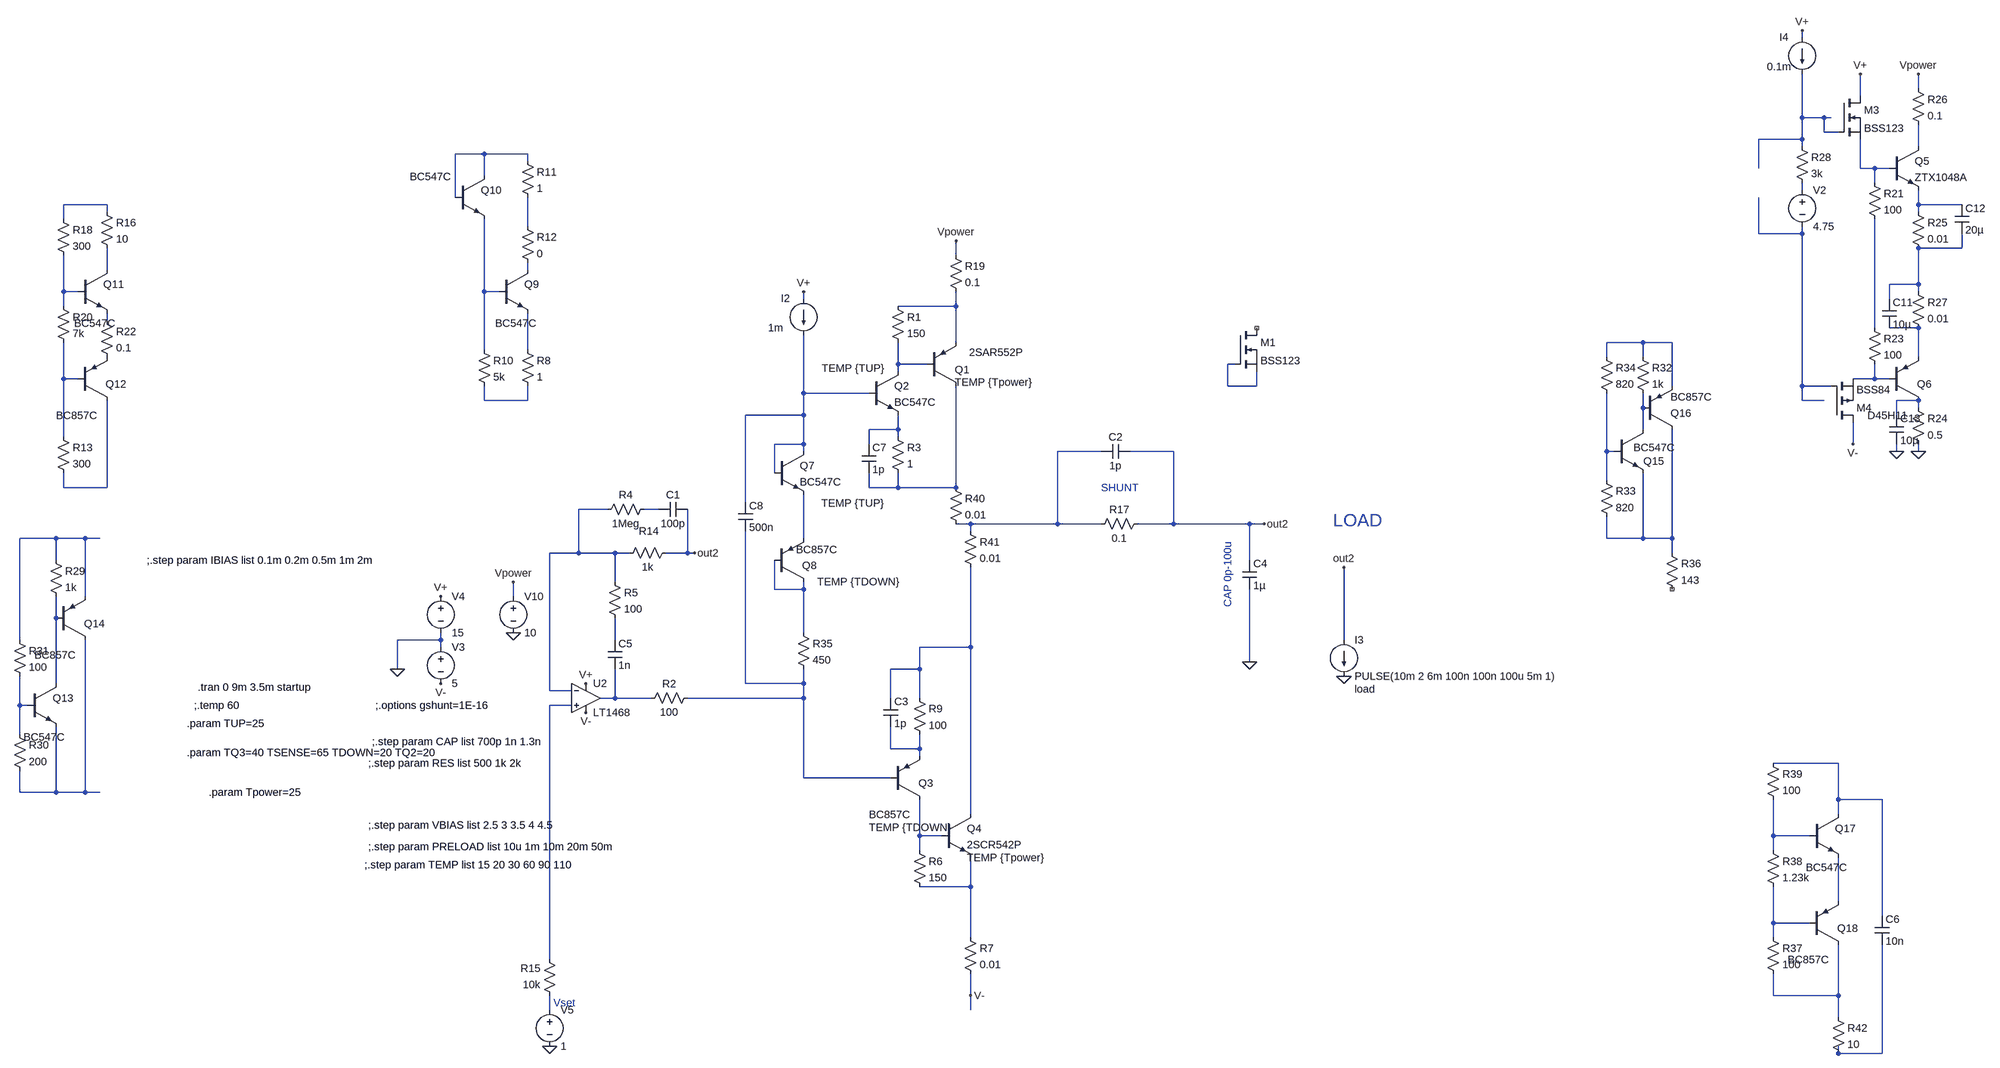
[diagram p0: schematic super_fast_push_pull_pass_element_selection.asc]
super_fast_push_pull_pass_element_selection.asc, the LTspice schematic file:
Version 4
SHEET 1 8456 1444
WIRE 2608 -864 2608 -880
WIRE 2864 -752 2864 -784
WIRE 2736 -736 2736 -784
WIRE 2608 -688 2608 -784
WIRE 2656 -688 2608 -688
WIRE 2672 -688 2656 -688
WIRE 2656 -656 2656 -688
WIRE 2688 -656 2656 -656
WIRE 2608 -640 2608 -688
WIRE 2608 -640 2512 -640
WIRE 2608 -624 2608 -640
WIRE 2864 -624 2864 -672
WIRE -608 -608 -672 -608
WIRE -512 -608 -608 -608
WIRE -512 -592 -512 -608
WIRE 2512 -576 2512 -640
WIRE 2736 -576 2736 -640
WIRE 2768 -576 2736 -576
WIRE 2800 -576 2768 -576
WIRE -608 -560 -608 -608
WIRE 2768 -544 2768 -576
WIRE 2608 -528 2608 -544
WIRE -672 -512 -672 -608
WIRE -1440 -496 -1536 -496
WIRE 2864 -496 2864 -528
WIRE 2960 -496 2864 -496
WIRE -1440 -480 -1440 -496
WIRE 2864 -480 2864 -496
WIRE -1536 -464 -1536 -496
WIRE -512 -448 -512 -512
WIRE 2512 -432 2512 -512
WIRE 2608 -432 2608 -448
WIRE 2608 -432 2512 -432
WIRE 2960 -400 2960 -432
WIRE 2960 -400 2864 -400
WIRE 432 -384 432 -416
WIRE -1440 -352 -1440 -400
WIRE -512 -352 -512 -368
WIRE 2864 -320 2864 -400
WIRE 2864 -320 2800 -320
WIRE -1536 -304 -1536 -384
WIRE -1504 -304 -1536 -304
WIRE -608 -304 -608 -464
WIRE -576 -304 -608 -304
WIRE 2864 -304 2864 -320
WIRE 96 -288 96 -304
WIRE 2800 -288 2800 -320
WIRE -1536 -272 -1536 -304
WIRE 432 -272 432 -304
WIRE 432 -272 304 -272
WIRE -1440 -240 -1440 -256
WIRE 2768 -224 2768 -464
WIRE 2864 -224 2800 -224
WIRE 432 -192 432 -272
WIRE 2192 -192 2112 -192
WIRE 2256 -192 2192 -192
WIRE -608 -176 -608 -304
WIRE -512 -176 -512 -256
WIRE 2112 -160 2112 -192
WIRE 2192 -160 2192 -192
WIRE 2864 -160 2864 -224
WIRE 304 -144 304 -192
WIRE 368 -144 304 -144
WIRE 1184 -144 1168 -144
WIRE 304 -128 304 -144
WIRE -1536 -112 -1536 -192
WIRE -1504 -112 -1536 -112
WIRE 2768 -112 2768 -144
WIRE 2768 -112 2720 -112
WIRE 2800 -112 2768 -112
WIRE 1168 -96 1168 -144
WIRE 1232 -96 1232 -128
WIRE 1232 -96 1168 -96
WIRE 2256 -96 2256 -192
WIRE 2608 -96 2608 -432
WIRE 2672 -96 2608 -96
WIRE 96 -80 96 -208
WIRE 240 -80 96 -80
WIRE -608 -64 -608 -96
WIRE -512 -64 -512 -96
WIRE -512 -64 -608 -64
WIRE 2608 -64 2608 -96
WIRE 2656 -64 2608 -64
WIRE 2864 -64 2816 -64
WIRE 2192 -48 2192 -80
WIRE 2864 -48 2864 -64
WIRE 96 -32 96 -80
WIRE 96 -32 -32 -32
WIRE 2816 -32 2816 -64
WIRE 304 0 304 -32
WIRE 304 0 240 0
WIRE 2192 0 2192 -48
WIRE -1536 16 -1536 -112
WIRE 304 16 304 0
WIRE 96 32 96 -32
WIRE 96 32 32 32
WIRE 240 32 240 0
WIRE 2720 32 2720 -16
WIRE 96 48 96 32
WIRE 752 48 656 48
WIRE 912 48 816 48
WIRE 2112 48 2112 -80
WIRE 2128 48 2112 48
WIRE 2816 48 2816 32
WIRE 2864 48 2864 32
WIRE 32 96 32 32
WIRE 2112 112 2112 48
WIRE -1536 128 -1536 96
WIRE -1440 128 -1440 -64
WIRE -1440 128 -1536 128
WIRE 240 128 240 96
WIRE 304 128 304 96
WIRE 304 128 240 128
WIRE 432 128 432 -96
WIRE 432 128 304 128
WIRE -32 160 -32 -32
WIRE -336 176 -400 176
WIRE -224 176 -256 176
WIRE 464 208 432 208
WIRE 656 208 656 48
WIRE 656 208 464 208
WIRE 752 208 656 208
WIRE 912 208 912 48
WIRE 912 208 832 208
WIRE 1216 208 912 208
WIRE 1248 208 1216 208
WIRE 464 224 464 208
WIRE -1552 240 -1632 240
WIRE -1488 240 -1552 240
WIRE -1456 240 -1488 240
WIRE 96 240 96 144
WIRE 2112 240 2112 192
WIRE 2192 240 2192 96
WIRE 2192 240 2112 240
WIRE 2256 240 2256 0
WIRE 2256 240 2192 240
WIRE -400 272 -400 176
WIRE -400 272 -464 272
WIRE -320 272 -400 272
WIRE -288 272 -320 272
WIRE -160 272 -160 176
WIRE -160 272 -208 272
WIRE -144 272 -160 272
WIRE 2256 272 2256 240
WIRE -1552 288 -1552 240
WIRE 1216 288 1216 208
WIRE -320 336 -320 272
WIRE 32 352 32 288
WIRE 96 352 96 336
WIRE 96 352 32 352
WIRE -1488 368 -1488 240
WIRE -544 368 -544 336
WIRE -1552 416 -1552 368
WIRE 96 448 96 352
WIRE -1632 464 -1632 240
WIRE -704 464 -704 448
WIRE -704 464 -800 464
WIRE -320 464 -320 416
WIRE 1424 464 1424 304
WIRE -704 480 -704 464
WIRE 464 480 464 304
WIRE 464 480 352 480
WIRE 1216 512 1216 352
WIRE -800 528 -800 464
WIRE 352 528 352 480
WIRE 352 528 288 528
WIRE -1552 560 -1552 416
WIRE -32 560 -32 224
WIRE 96 560 96 528
WIRE 96 560 -32 560
WIRE -464 576 -464 272
WIRE -416 576 -464 576
WIRE -320 592 -320 528
WIRE -320 592 -352 592
WIRE -240 592 -320 592
WIRE 96 592 96 560
WIRE 96 592 -160 592
WIRE 288 592 288 528
WIRE 352 592 352 528
WIRE -1632 608 -1632 544
WIRE -1616 608 -1632 608
WIRE -416 608 -464 608
WIRE -1632 672 -1632 608
WIRE 288 704 288 656
WIRE 352 704 352 672
WIRE 352 704 288 704
WIRE 352 720 352 704
WIRE 2688 736 2544 736
WIRE 96 768 96 592
WIRE 288 768 96 768
WIRE -1632 800 -1632 752
WIRE -1552 800 -1552 656
WIRE -1552 800 -1632 800
WIRE -1488 800 -1488 464
WIRE -1488 800 -1552 800
WIRE -1456 800 -1488 800
WIRE 2688 816 2688 736
WIRE 2784 816 2688 816
WIRE 464 848 464 480
WIRE 2688 848 2688 816
WIRE 352 896 352 816
WIRE 400 896 352 896
WIRE 2544 896 2544 816
WIRE 2624 896 2544 896
WIRE 352 928 352 896
WIRE 2544 928 2544 896
WIRE 464 1008 464 944
WIRE 464 1008 352 1008
WIRE 2688 1040 2688 944
WIRE 2784 1072 2784 816
WIRE 2544 1088 2544 1008
WIRE 2624 1088 2544 1088
WIRE 464 1120 464 1008
WIRE 2544 1120 2544 1088
WIRE -464 1168 -464 608
WIRE 464 1248 464 1200
WIRE 2544 1248 2544 1200
WIRE 2688 1248 2688 1136
WIRE 2688 1248 2544 1248
WIRE -464 1280 -464 1248
WIRE 464 1280 464 1248
WIRE 2688 1296 2688 1248
WIRE 2688 1376 2688 1360
WIRE 2784 1376 2784 1136
WIRE 2784 1376 2688 1376
FLAG -800 528 0
FLAG -704 368 V+
FLAG -704 560 V-
FLAG -384 560 V+
FLAG -384 624 V-
FLAG 1248 208 out2
FLAG 1216 512 0
FLAG -464 1360 0
FLAG 1424 304 out2
FLAG -144 272 out2
FLAG -544 336 Vpower
FLAG -544 448 0
FLAG 432 -416 Vpower
FLAG 96 -304 V+
FLAG 1424 544 0
FLAG 2864 48 0
FLAG 2720 32 V-
FLAG 2864 -784 Vpower
FLAG 2736 -784 V+
FLAG 2608 -880 V+
FLAG 2816 48 0
FLAG 464 1248 V-
DATAFLAG 1136 208 ""
SYMBOL voltage -704 464 R0
WINDOW 123 0 0 Left 0
WINDOW 39 0 0 Left 0
SYMATTR InstName V3
SYMATTR Value 5
SYMBOL voltage -704 352 R0
WINDOW 123 0 0 Left 0
WINDOW 39 0 0 Left 0
SYMATTR InstName V4
SYMATTR Value 15
SYMBOL cap -336 464 R0
SYMATTR InstName C5
SYMATTR Value 1n
SYMBOL res -192 256 R90
WINDOW 0 -16 53 VBottom 2
WINDOW 3 32 56 VTop 2
SYMATTR InstName R14
SYMATTR Value 1k
SYMBOL res -448 1264 R180
WINDOW 0 36 76 Left 2
WINDOW 3 36 40 Left 2
SYMATTR InstName R15
SYMATTR Value 10k
SYMBOL res 736 224 R270
WINDOW 0 32 56 VTop 2
WINDOW 3 0 56 VBottom 2
SYMATTR InstName R17
SYMATTR Value 0.1
SYMBOL cap 1200 288 R0
SYMATTR InstName C4
SYMATTR Value 1µ
SYMATTR SpiceLine Rser=0.1
SYMBOL voltage -464 1264 R0
WINDOW 123 0 0 Left 0
WINDOW 39 0 0 Left 0
SYMATTR InstName V5
SYMATTR Value 1
SYMBOL OpAmps\\LT1468 -384 528 R0
SYMATTR InstName U2
SYMBOL res -144 576 R90
WINDOW 0 0 56 VBottom 2
WINDOW 3 32 56 VTop 2
SYMATTR InstName R2
SYMATTR Value 100
SYMBOL voltage -544 352 R0
WINDOW 123 0 0 Left 0
WINDOW 39 0 0 Left 0
SYMATTR InstName V10
SYMATTR Value 10
SYMBOL res -336 320 R0
SYMATTR InstName R5
SYMATTR Value 100
SYMBOL current 96 -288 R0
WINDOW 0 -50 -1 Left 2
WINDOW 3 -78 64 Left 2
WINDOW 123 0 0 Left 0
WINDOW 39 0 0 Left 0
SYMATTR InstName I2
SYMATTR Value 1m
SYMBOL current 1424 464 R0
WINDOW 123 0 0 Left 0
WINDOW 39 24 108 Left 2
SYMATTR SpiceLine load
SYMATTR InstName I3
SYMATTR Value PULSE(10m 2 6m 100n 100n 100u 5m 1)
SYMBOL cap -160 160 R90
WINDOW 0 0 32 VBottom 2
WINDOW 3 32 32 VTop 2
SYMATTR InstName C1
SYMATTR Value 100p
SYMBOL res -240 160 R90
WINDOW 0 0 56 VBottom 2
WINDOW 3 32 56 VTop 2
SYMATTR InstName R4
SYMATTR Value 1Meg
SYMBOL cap 816 32 R90
WINDOW 0 0 32 VBottom 2
WINDOW 3 32 32 VTop 2
SYMATTR InstName C2
SYMATTR Value 1p
SYMBOL res 416 -400 R0
SYMATTR InstName R19
SYMATTR Value 0.1
SYMBOL npn 2800 -624 R0
SYMATTR InstName Q5
SYMATTR Value ZTX1048A
SYMBOL nmos 2688 -736 R0
SYMATTR InstName M3
SYMATTR Value BSS123
SYMBOL pnp 2800 -64 M180
WINDOW 0 61 36 Left 2
WINDOW 3 -48 -33 Left 2
SYMATTR InstName Q6
SYMATTR Value D45H11
SYMBOL pmos 2672 -16 M180
SYMATTR InstName M4
SYMATTR Value BSS84
SYMBOL voltage 2608 -544 R0
WINDOW 123 0 0 Left 0
WINDOW 39 0 0 Left 0
SYMATTR InstName V2
SYMATTR Value 4.75
SYMBOL current 2608 -864 R0
WINDOW 0 -50 -1 Left 2
WINDOW 3 -78 64 Left 2
WINDOW 123 0 0 Left 0
WINDOW 39 0 0 Left 0
SYMATTR InstName I4
SYMATTR Value 0.1m
SYMBOL res 2752 -560 R0
SYMATTR InstName R21
SYMATTR Value 100
SYMBOL res 2752 -240 R0
SYMATTR InstName R23
SYMATTR Value 100
SYMBOL res 2848 -64 R0
SYMATTR InstName R24
SYMATTR Value 0.5
SYMBOL res 2848 -496 R0
SYMATTR InstName R25
SYMATTR Value 0.01
SYMBOL res 2848 -768 R0
SYMATTR InstName R26
SYMATTR Value 0.1
SYMBOL cap 2784 -288 R0
SYMATTR InstName C11
SYMATTR Value 10µ
SYMBOL res 2848 -320 R0
SYMATTR InstName R27
SYMATTR Value 0.01
SYMBOL cap 2944 -496 R0
SYMATTR InstName C12
SYMATTR Value 20µ
SYMBOL res 2592 -640 R0
SYMATTR InstName R28
SYMATTR Value 3k
SYMBOL cap 2800 -32 R0
SYMATTR InstName C13
SYMATTR Value 10µ
SYMBOL npn 240 -128 R0
WINDOW 39 -104 -7 Left 2
SYMATTR SpiceLine TEMP {TUP}
SYMATTR InstName Q2
SYMATTR Value BC547C
SYMBOL pnp 368 -96 M180
WINDOW 0 61 36 Left 2
WINDOW 3 93 74 Left 2
WINDOW 39 61 8 Left 2
SYMATTR InstName Q1
SYMATTR Value 2SAR552P
SYMATTR SpiceLine TEMP {Tpower}
SYMBOL res 288 -288 R0
SYMATTR InstName R1
SYMATTR Value 150
SYMBOL res 288 0 R0
SYMATTR InstName R3
SYMATTR Value 1
SYMBOL nmos 1184 -224 R0
SYMATTR InstName M1
SYMATTR Value BSS123
SYMBOL pnp 288 816 M180
WINDOW 0 61 36 Left 2
WINDOW 3 -48 -33 Left 2
WINDOW 39 -48 -61 Left 2
SYMATTR InstName Q3
SYMATTR Value BC857C
SYMATTR SpiceLine TEMP {TDOWN}
SYMBOL npn 400 848 R0
WINDOW 39 56 96 Left 2
SYMATTR SpiceLine TEMP {Tpower}
SYMATTR InstName Q4
SYMATTR Value 2SCR542P
SYMBOL res 336 912 R0
SYMATTR InstName R6
SYMATTR Value 150
SYMBOL res 448 1104 R0
SYMATTR InstName R7
SYMATTR Value 0.01
SYMBOL npn 32 48 R0
WINDOW 39 103 114 Left 2
SYMATTR SpiceLine TEMP {TUP}
SYMATTR InstName Q7
SYMATTR Value BC547C
SYMBOL pnp 32 336 M180
WINDOW 0 61 36 Left 2
WINDOW 3 47 71 Left 2
WINDOW 39 94 0 Left 2
SYMATTR InstName Q8
SYMATTR Value BC857C
SYMATTR SpiceLine TEMP {TDOWN}
SYMBOL res 336 576 R0
SYMATTR InstName R9
SYMATTR Value 100
SYMBOL npn -576 -352 R0
WINDOW 3 -8 118 Left 2
SYMATTR Value BC547C
SYMATTR InstName Q9
SYMATTR SpiceLine TEMP {TQ2}
SYMBOL res -624 -192 R0
SYMATTR InstName R10
SYMATTR Value 5k
SYMBOL res -528 -608 R0
SYMATTR InstName R11
SYMATTR Value 1
SYMBOL cap 2768 1072 R0
SYMATTR InstName C6
SYMATTR Value 10n
SYMBOL npn -672 -560 R0
WINDOW 3 -100 2 Left 2
SYMATTR Value BC547C
SYMATTR InstName Q10
SYMATTR SpiceLine TEMP {TQ2}
SYMBOL res -528 -192 R0
SYMATTR InstName R8
SYMATTR Value 1
SYMBOL res -528 -464 R0
SYMATTR InstName R12
SYMATTR Value 0
SYMBOL npn -1504 -352 R0
WINDOW 3 -8 118 Left 2
SYMATTR Value BC547C
SYMATTR InstName Q11
SYMATTR SpiceLine TEMP {TQ2}
SYMBOL res -1552 0 R0
SYMATTR InstName R13
SYMATTR Value 300
SYMBOL pnp -1504 -64 M180
WINDOW 0 61 36 Left 2
WINDOW 3 -48 -33 Left 2
SYMATTR InstName Q12
SYMATTR Value BC857C
SYMATTR SpiceLine TEMP {TQ2}
SYMBOL res -1552 -480 R0
SYMATTR InstName R18
SYMATTR Value 300
SYMBOL res -1552 -288 R0
SYMATTR InstName R20
SYMATTR Value 7k
SYMBOL res -1456 -496 R0
SYMATTR InstName R16
SYMATTR Value 10
SYMBOL res -1456 -256 R0
SYMATTR InstName R22
SYMATTR Value 0.1
SYMBOL npn -1616 560 R0
WINDOW 3 -8 118 Left 2
SYMATTR Value BC547C
SYMATTR InstName Q13
SYMATTR SpiceLine TEMP {TQ2}
SYMBOL pnp -1552 464 M180
WINDOW 0 61 36 Left 2
WINDOW 3 -48 -33 Left 2
SYMATTR InstName Q14
SYMATTR Value BC857C
SYMATTR SpiceLine TEMP {TQ2}
SYMBOL res -1568 272 R0
SYMATTR InstName R29
SYMATTR Value 1k
SYMBOL res -1648 656 R0
SYMATTR InstName R30
SYMATTR Value 200
SYMBOL res -1648 448 R0
SYMATTR InstName R31
SYMATTR Value 100
SYMBOL npn 2128 0 R0
WINDOW 3 43 40 Left 2
WINDOW 0 65 70 Left 2
SYMATTR Value BC547C
SYMATTR InstName Q15
SYMATTR SpiceLine TEMP {TSENSE}
SYMBOL pnp 2192 0 M180
WINDOW 0 61 36 Left 2
WINDOW 3 61 72 Left 2
SYMATTR InstName Q16
SYMATTR Value BC857C
SYMATTR SpiceLine TEMP {TQ2}
SYMBOL res 2176 -176 R0
SYMATTR InstName R32
SYMATTR Value 1k
SYMBOL res 2096 96 R0
SYMATTR InstName R33
SYMATTR Value 820
SYMBOL res 2096 -176 R0
SYMATTR InstName R34
SYMATTR Value 820
SYMBOL res 2240 256 R0
SYMATTR InstName R36
SYMATTR Value 143
SYMBOL npn 2624 848 R0
WINDOW 3 -8 118 Left 2
SYMATTR Value BC547C
SYMATTR InstName Q17
SYMATTR SpiceLine TEMP {TUP}
SYMBOL pnp 2624 1136 M180
WINDOW 0 61 36 Left 2
WINDOW 3 -48 -33 Left 2
SYMATTR InstName Q18
SYMATTR Value BC857C
SYMATTR SpiceLine TEMP {TUP}
SYMBOL res 2528 1104 R0
SYMATTR InstName R37
SYMATTR Value 100
SYMBOL res 2528 912 R0
SYMATTR InstName R38
SYMATTR Value 1.23k
SYMBOL res 2528 720 R0
SYMATTR InstName R39
SYMATTR Value 100
SYMBOL res 2672 1280 R0
SYMATTR InstName R42
SYMATTR Value 10
SYMBOL cap 272 592 R0
SYMATTR InstName C3
SYMATTR Value 1p
SYMATTR SpiceLine Rser=1
SYMBOL cap 224 32 R0
SYMATTR InstName C7
SYMATTR Value 1p
SYMATTR SpiceLine Rser=1
SYMBOL res 80 432 R0
SYMATTR InstName R35
SYMATTR Value 450
SYMBOL cap -48 160 R0
SYMATTR InstName C8
SYMATTR Value 500n
SYMBOL res 416 112 R0
SYMATTR InstName R40
SYMATTR Value 0.01
SYMBOL res 448 208 R0
SYMATTR InstName R41
SYMATTR Value 0.01
TEXT -1240 568 Left 2 !.tran 0 9m 3.5m startup
TEXT -456 1264 Left 2 ;Vset
TEXT 752 128 Left 2 ;SHUNT
TEXT 1400 200 Left 4 ;LOAD
TEXT 1168 392 VLeft 2 ;CAP 0p-100u
TEXT -856 688 Left 2 !;.step param CAP list 700p 1n 1.3n
TEXT -864 736 Left 2 !;.step param RES list 500 1k 2k
TEXT -1352 288 Left 2 !;.step param IBIAS list 0.1m 0.2m 0.5m 1m 2m
TEXT -864 872 Left 2 !;.step param VBIAS list 2.5 3 3.5 4 4.5
TEXT -864 920 Left 2 !;.step param PRELOAD list 10u 1m 10m 20m 50m
TEXT -1248 608 Left 2 !;.temp 60
TEXT -872 960 Left 2 !;.step param TEMP list 15 20 30 60 90 110
TEXT -848 608 Left 2 !;.options gshunt=1E-16
TEXT -1264 648 Left 2 !.param TUP=25
TEXT -1264 712 Left 2 !.param TQ3=40 TSENSE=65 TDOWN=20 TQ2=20
TEXT -1216 800 Left 2 !.param Tpower=25

The netlist it stands for:
* super_fast_push_pull_pass_element_selection.asc
V3 0 V- 5
V4 V+ 0 15
C5 N041 N044 1n
R14 out2 N034 1k
R15 N056 N046 10k
R17 N030 out2 0.1
C4 out2 0 1µ Rser=0.1
V5 N056 0 1
XU2 N046 N034 V+ V- N044 LT1468  ; pins In+ In- V+ V- OUT
R2 N043 N044 100
V10 Vpower 0 10
R5 N034 N041 100
I2 V+ N025 1m
I3 out2 0 PULSE(10m 2 6m 100n 100n 100u 5m 1) load
C1 out2 N035 100p
R4 N035 N034 1Meg
C2 out2 N030 1p
R19 Vpower N015 0.1
Q5 N002 N004 N007 0 ZTX1048A
M3 V+ N001 N004 N004 BSS123
Q6 N027 N024 N018 0 D45H11
M4 V- N009 N024 N024 BSS84
V2 N005 N009 4.75
I4 V+ N001 0.1m
R21 N004 N017 100
R23 N017 N024 100
R24 N027 0 0.5
R25 N007 N010 0.01
R26 Vpower N002 0.1
C11 N010 N018 10µ
R27 N010 N018 0.01
C12 N007 N010 20µ
R28 N001 N005 3k
C13 N027 0 10µ
Q2 N021 N025 N029 0 BC547C TEMP {TUP}
Q1 N033 N021 N015 0 2SAR552P TEMP {Tpower}
R1 N015 N021 150
R3 N029 N033 1
M1 NC_01 N022 N022 N022 BSS123
Q3 N050 N043 N047 0 BC857C TEMP {TDOWN}
Q4 N042 N050 N052 0 2SCR542P TEMP {Tpower}
R6 N050 N052 150
R7 N052 V- 0.01
Q7 N025 N025 N037 0 BC547C TEMP {TUP}
Q8 N039 N039 N037 0 BC857C TEMP {TDOWN}
R9 N042 N047 100
Q9 N012 N014 N020 0 BC547C TEMP {TQ2}
R10 N014 N026 5k
R11 N003 N008 1
C6 N048 N057 10n
Q10 N003 N003 N014 0 BC547C TEMP {TQ2}
R8 N020 N026 1
R12 N008 N012 0
Q11 N011 N013 N016 0 BC547C TEMP {TQ2}
R13 N023 N032 300
Q12 N032 N023 P001 0 BC857C TEMP {TQ2}
R18 N006 N013 300
R20 N013 N023 7k
R16 N006 N011 10
R22 N016 P001 0.1
Q13 N040 N045 N049 0 BC547C TEMP {TQ2}
Q14 N049 N040 N036 0 BC857C TEMP {TQ2}
R29 N036 N040 1k
R30 N045 N049 200
R31 N036 N045 100
Q15 N028 N031 N038 0 BC547C TEMP {TSENSE}
Q16 N038 N028 N019 0 BC857C TEMP {TQ2}
R32 N019 N028 1k
R33 N031 N038 820
R34 N019 N031 820
R36 N038 NC_02 143
Q17 N048 N051 N053 0 BC547C TEMP {TUP}
Q18 N055 N054 N053 0 BC857C TEMP {TUP}
R37 N054 N055 100
R38 N051 N054 1.23k
R39 N048 N051 100
R42 N055 N057 10
C3 N042 N047 1p Rser=1
C7 N029 N033 1p Rser=1
R35 N039 N043 450
C8 N025 N043 500n
R40 N033 N030 0.01
R41 N030 N042 0.01
.model NPN NPN
.model PNP PNP
.lib standard.bjt
.model NMOS NMOS
.model PMOS PMOS
.lib standard.mos
.tran 0 9m 3.5m startup
* Vset
* SHUNT
* LOAD
* CAP 0p-100u
;.step param CAP list 700p 1n 1.3n
;.step param RES list 500 1k 2k
;.step param IBIAS list 0.1m 0.2m 0.5m 1m 2m
;.step param VBIAS list 2.5 3 3.5 4 4.5
;.step param PRELOAD list 10u 1m 10m 20m 50m
;.temp 60
;.step param TEMP list 15 20 30 60 90 110
;.options gshunt=1E-16
.param TUP=25
.param TQ3=40 TSENSE=65 TDOWN=20 TQ2=20
.param Tpower=25
.backanno
.end